# EAGLE design papilio_cam_board (EAGLE 6.2)
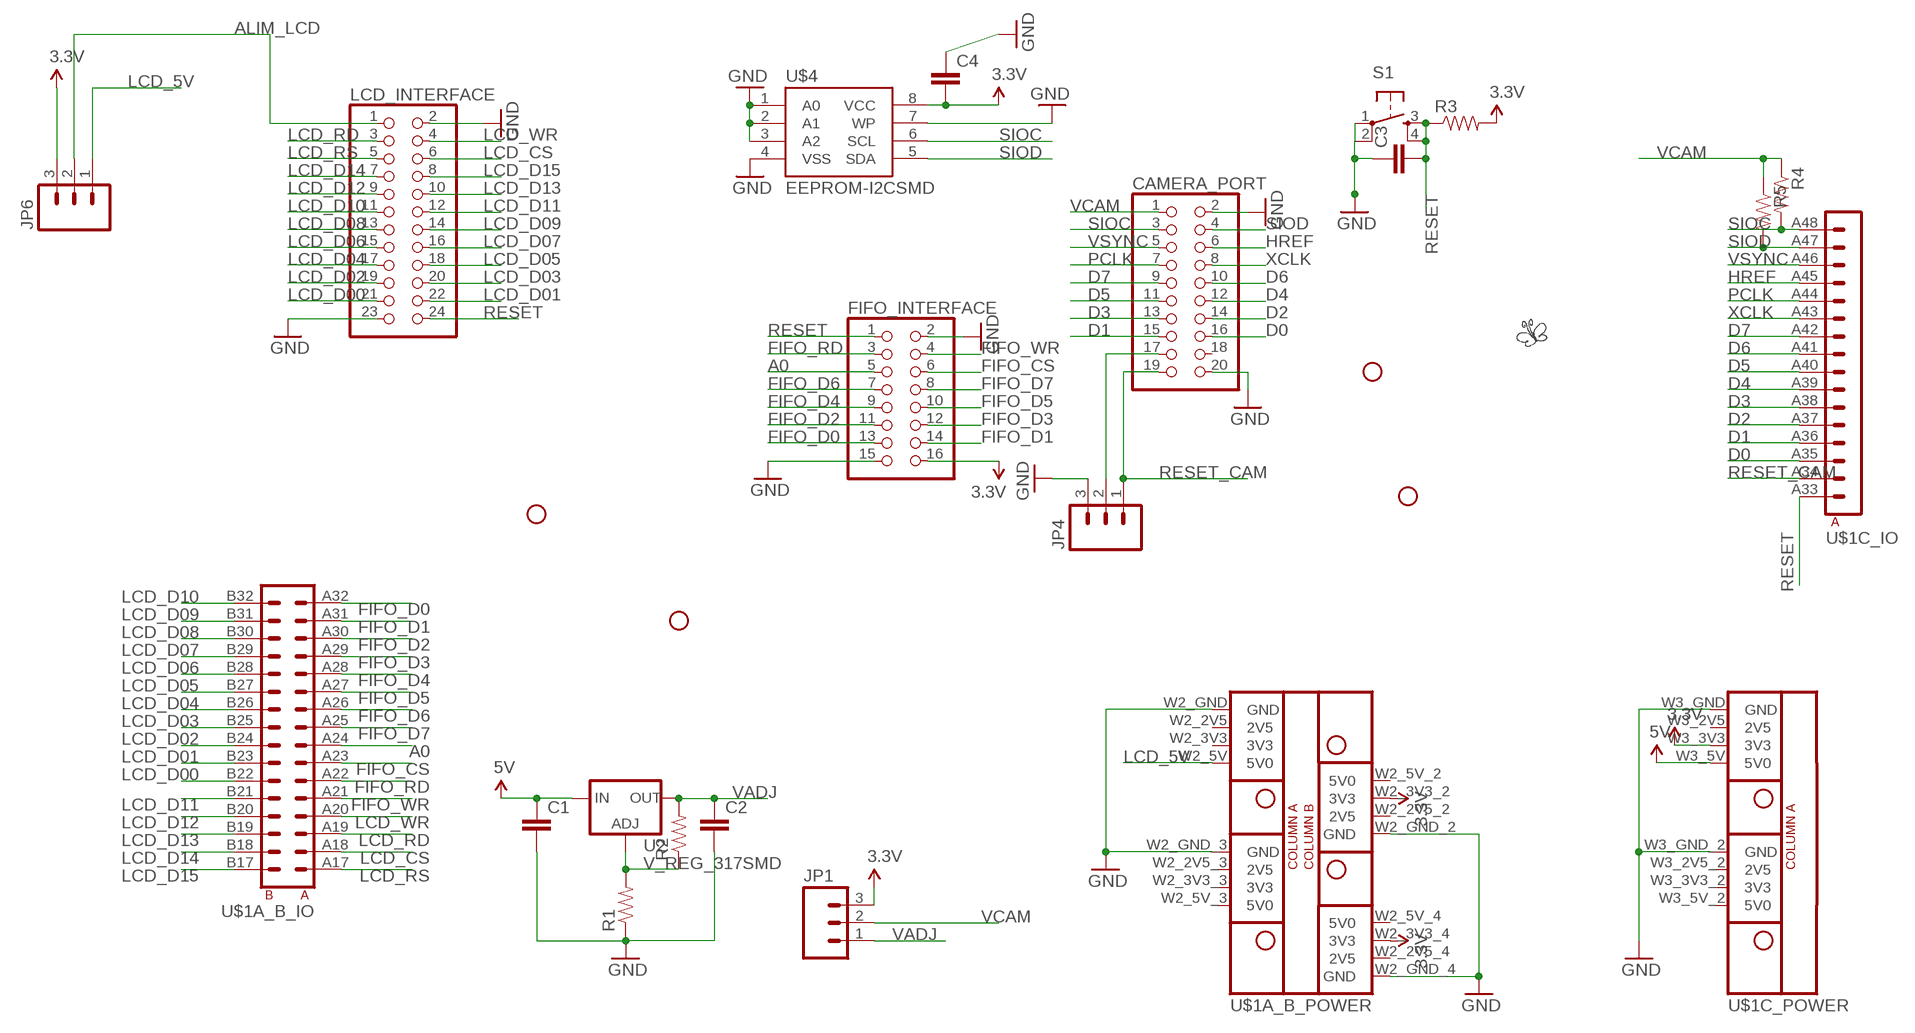
[diagram p0: schematic, sheet 1]

## Parts
C1  CAP0805  [0805]
C2  CAP0805  [0805]
C3  CAP0805  [0805]
C4  CAP0805  [0805]
CAMERA_PORT  PINHD-2X10  [2X10]
FIFO_INTERFACE  PINHD-2X8  [2X08]
JP1  M03PTH  [1X03]
JP2  STAND-OFF  [STAND-OFF]
JP3  STAND-OFF  [STAND-OFF]
JP4  M03PTH  [1X03]
JP5  STAND-OFF  [STAND-OFF]
JP6  M03PTH  [1X03]
JP7  STAND-OFF  [STAND-OFF]
LCD_INTERFACE  PINHD-2X12  [2X12]
LOGO1  BUTTERFLY_LOGO  [BUTTERFLY_LOGO]
R1  RESISTOR0805-RES  [0805]
R2  RESISTOR0805-RES  [0805]
R3  RESISTOR0805-RES  [0805]
R4  RESISTOR0805-RES  [0805]
R5  RESISTOR0805-RES  [0805]
S1  TAC_SWITCHSMD  [TACTILE_SWITCH_SMD]
U2  V_REG_317SMD  [SOT223]
U$1  MEGAWING_FULL_P1MEGAWING_P1  [MEGAWING_FULL_NOHOLES_P1]
U$4  EEPROM-I2CSMD  [SO08]

## Nets
3.3V: C4.2 FIFO_INTERFACE.16 JP1.3 JP6.3 R3.2 U$1.W2_3V3_2(A_B_POWER:3V3) U$1.W2_3V3_4(A_B_POWER:3V3) U$1.W3_3V3(C_POWER:3V3) U$4.8(VCC)
5V: C1.1 U2.3(IN) U$1.W3_5V(C_POWER:5V0)
A0: FIFO_INTERFACE.5 U$1.A24(A_B_IO:A8)
ALIM_LCD: JP6.2 LCD_INTERFACE.1
D0: CAMERA_PORT.16 U$1.A35(C_IO:A3)
D1: CAMERA_PORT.15 U$1.A36(C_IO:A4)
D2: CAMERA_PORT.14 U$1.A37(C_IO:A5)
D3: CAMERA_PORT.13 U$1.A38(C_IO:A6)
D4: CAMERA_PORT.12 U$1.A39(C_IO:A7)
D5: CAMERA_PORT.11 U$1.A40(C_IO:A8)
D6: CAMERA_PORT.10 U$1.A41(C_IO:A9)
D7: CAMERA_PORT.9 U$1.A42(C_IO:A10)
FIFO_CS: FIFO_INTERFACE.6 U$1.A23(A_B_IO:A7)
FIFO_D0: FIFO_INTERFACE.13 U$1.A32(A_B_IO:A16)
FIFO_D1: FIFO_INTERFACE.14 U$1.A31(A_B_IO:A15)
FIFO_D2: FIFO_INTERFACE.11 U$1.A30(A_B_IO:A14)
FIFO_D3: FIFO_INTERFACE.12 U$1.A29(A_B_IO:A13)
FIFO_D4: FIFO_INTERFACE.9 U$1.A28(A_B_IO:A12)
FIFO_D5: FIFO_INTERFACE.10 U$1.A27(A_B_IO:A11)
FIFO_D6: FIFO_INTERFACE.7 U$1.A26(A_B_IO:A10)
FIFO_D7: FIFO_INTERFACE.8 U$1.A25(A_B_IO:A9)
FIFO_RD: FIFO_INTERFACE.3 U$1.A22(A_B_IO:A6)
FIFO_WR: FIFO_INTERFACE.4 U$1.A21(A_B_IO:A5)
GND: C1.2 C2.2 C3.1 C4.1 CAMERA_PORT.2 CAMERA_PORT.20 FIFO_INTERFACE.2 FIFO_INTERFACE.15 JP4.3 LCD_INTERFACE.2 LCD_INTERFACE.23 R1.1 S1.1 S1.2 U$1.W2_GND(A_B_POWER:GND) U$1.W2_GND_2(A_B_POWER:GND) U$1.W2_GND_3(A_B_POWER:GND) U$1.W2_GND_4(A_B_POWER:GND) U$1.W3_GND(C_POWER:GND) U$1.W3_GND_2(C_POWER:GND) U$4.1(A0) U$4.2(A1) U$4.3(A2) U$4.4(VSS) U$4.7(WP)
HREF: CAMERA_PORT.6 U$1.A45(C_IO:A13)
LCD_5V: JP6.1 U$1.W2_5V(A_B_POWER:5V0)
LCD_CS: LCD_INTERFACE.6 U$1.A18(A_B_IO:A2)
LCD_D00: LCD_INTERFACE.21 U$1.B22(A_B_IO:B6)
LCD_D01: LCD_INTERFACE.22 U$1.B23(A_B_IO:B7)
LCD_D02: LCD_INTERFACE.19 U$1.B24(A_B_IO:B8)
LCD_D03: LCD_INTERFACE.20 U$1.B25(A_B_IO:B9)
LCD_D04: LCD_INTERFACE.17 U$1.B26(A_B_IO:B10)
LCD_D05: LCD_INTERFACE.18 U$1.B27(A_B_IO:B11)
LCD_D06: LCD_INTERFACE.15 U$1.B28(A_B_IO:B12)
LCD_D07: LCD_INTERFACE.16 U$1.B29(A_B_IO:B13)
LCD_D08: LCD_INTERFACE.13 U$1.B30(A_B_IO:B14)
LCD_D09: LCD_INTERFACE.14 U$1.B31(A_B_IO:B15)
LCD_D10: LCD_INTERFACE.11 U$1.B32(A_B_IO:B16)
LCD_D11: LCD_INTERFACE.12 U$1.B21(A_B_IO:B5)
LCD_D12: LCD_INTERFACE.9 U$1.B20(A_B_IO:B4)
LCD_D13: LCD_INTERFACE.10 U$1.B19(A_B_IO:B3)
LCD_D14: LCD_INTERFACE.7 U$1.B18(A_B_IO:B2)
LCD_D15: LCD_INTERFACE.8 U$1.B17(A_B_IO:B1)
LCD_RD: LCD_INTERFACE.3 U$1.A19(A_B_IO:A3)
LCD_RS: LCD_INTERFACE.5 U$1.A17(A_B_IO:A1)
LCD_WR: LCD_INTERFACE.4 U$1.A20(A_B_IO:A4)
N$1: R1.2 R2.1 U2.1(ADJ)
N$2: CAMERA_PORT.17 JP4.2
PCLK: CAMERA_PORT.7 U$1.A44(C_IO:A12)
RESET: C3.2 FIFO_INTERFACE.1 LCD_INTERFACE.24 R3.1 S1.3 S1.4 U$1.A33(C_IO:A1)
RESET_CAM: CAMERA_PORT.19 JP4.1 U$1.A34(C_IO:A2)
SIOC: CAMERA_PORT.3 R4.2 U$1.A48(C_IO:A16) U$4.6(SCL)
SIOD: CAMERA_PORT.4 R5.2 U$1.A47(C_IO:A15) U$4.5(SDA)
VADJ: C2.1 JP1.1 R2.2 U2.2(OUT)
VCAM: CAMERA_PORT.1 JP1.2 R4.1 R5.1
VSYNC: CAMERA_PORT.5 U$1.A46(C_IO:A14)
XCLK: CAMERA_PORT.8 U$1.A43(C_IO:A11)
Unconnected: CAMERA_PORT.18 U$1.W2_2V5(A_B_POWER:2V5) U$1.W2_2V5_2(A_B_POWER:2V5) U$1.W2_2V5_3(A_B_POWER:2V5) U$1.W2_2V5_4(A_B_POWER:2V5) U$1.W2_3V3(A_B_POWER:3V3) U$1.W2_3V3_3(A_B_POWER:3V3) U$1.W2_5V_2(A_B_POWER:5V0) U$1.W2_5V_3(A_B_POWER:5V0) U$1.W2_5V_4(A_B_POWER:5V0) U$1.W3_2V5(C_POWER:2V5) U$1.W3_2V5_2(C_POWER:2V5) U$1.W3_3V3_2(C_POWER:3V3) U$1.W3_5V_2(C_POWER:5V0)

## Library data of the parts
C1-C4 = SparkFun:CAP: Capacitor Standard 0603 ceramic capacitor, and 0.1" leaded capacitor.
CAMERA_PORT = pinhead:PINHD-2X10: PIN HEADER
FIFO_INTERFACE = pinhead:PINHD-2X8: PIN HEADER
JP1 JP4 JP6 = SparkFun:M03: Header 3 Standard 3-pin 0.1" header. Use with straight break away headers (SKU : PRT-00116), right angle break away headers (PRT-00553), swiss pins (PRT-00743), machine pins (PRT-00117), and female headers (PRT-00115). Molex polarized connector foot print use with SKU : PRT-08232 with associated crimp pins and housings.
JP2 JP3 JP5 JP7 = SparkFun:STAND-OFF: Stand Off This is the mechanical footprint for a #4 phillips button head screw. Use the keepout ring to avoid running the screw head into surrounding components. SKU : PRT-00447
LCD_INTERFACE = pinhead:PINHD-2X12: PIN HEADER
LOGO1 = Papilio:BUTTERFLY_LOGO
R1-R5 = SparkFun:RESISTOR: Resistor Basic schematic elements and footprints for 0603, 1206, and PTH resistors.
S1 = SparkFun:TAC_SWITCH: Momentary Switch Button commonly used for reset or general input. Spark Fun Electronics SKU : COM-00097
U2 = SparkFun:V_REG_317: Voltage Regulator Standard LM317 adjustable voltage regulator. AOI (Adjust Output Input). Google 'LM317 Calculator' for easy to use app to get the two resistor values needed. 240/720 for 5V output. 240/390 for 3.3V output. Spark Fun Electronics SKU : COM-00527
U$1 = Papilio:MEGAWING_FULL_P1
U$4 = SparkFun:EEPROM-I2C

## Board
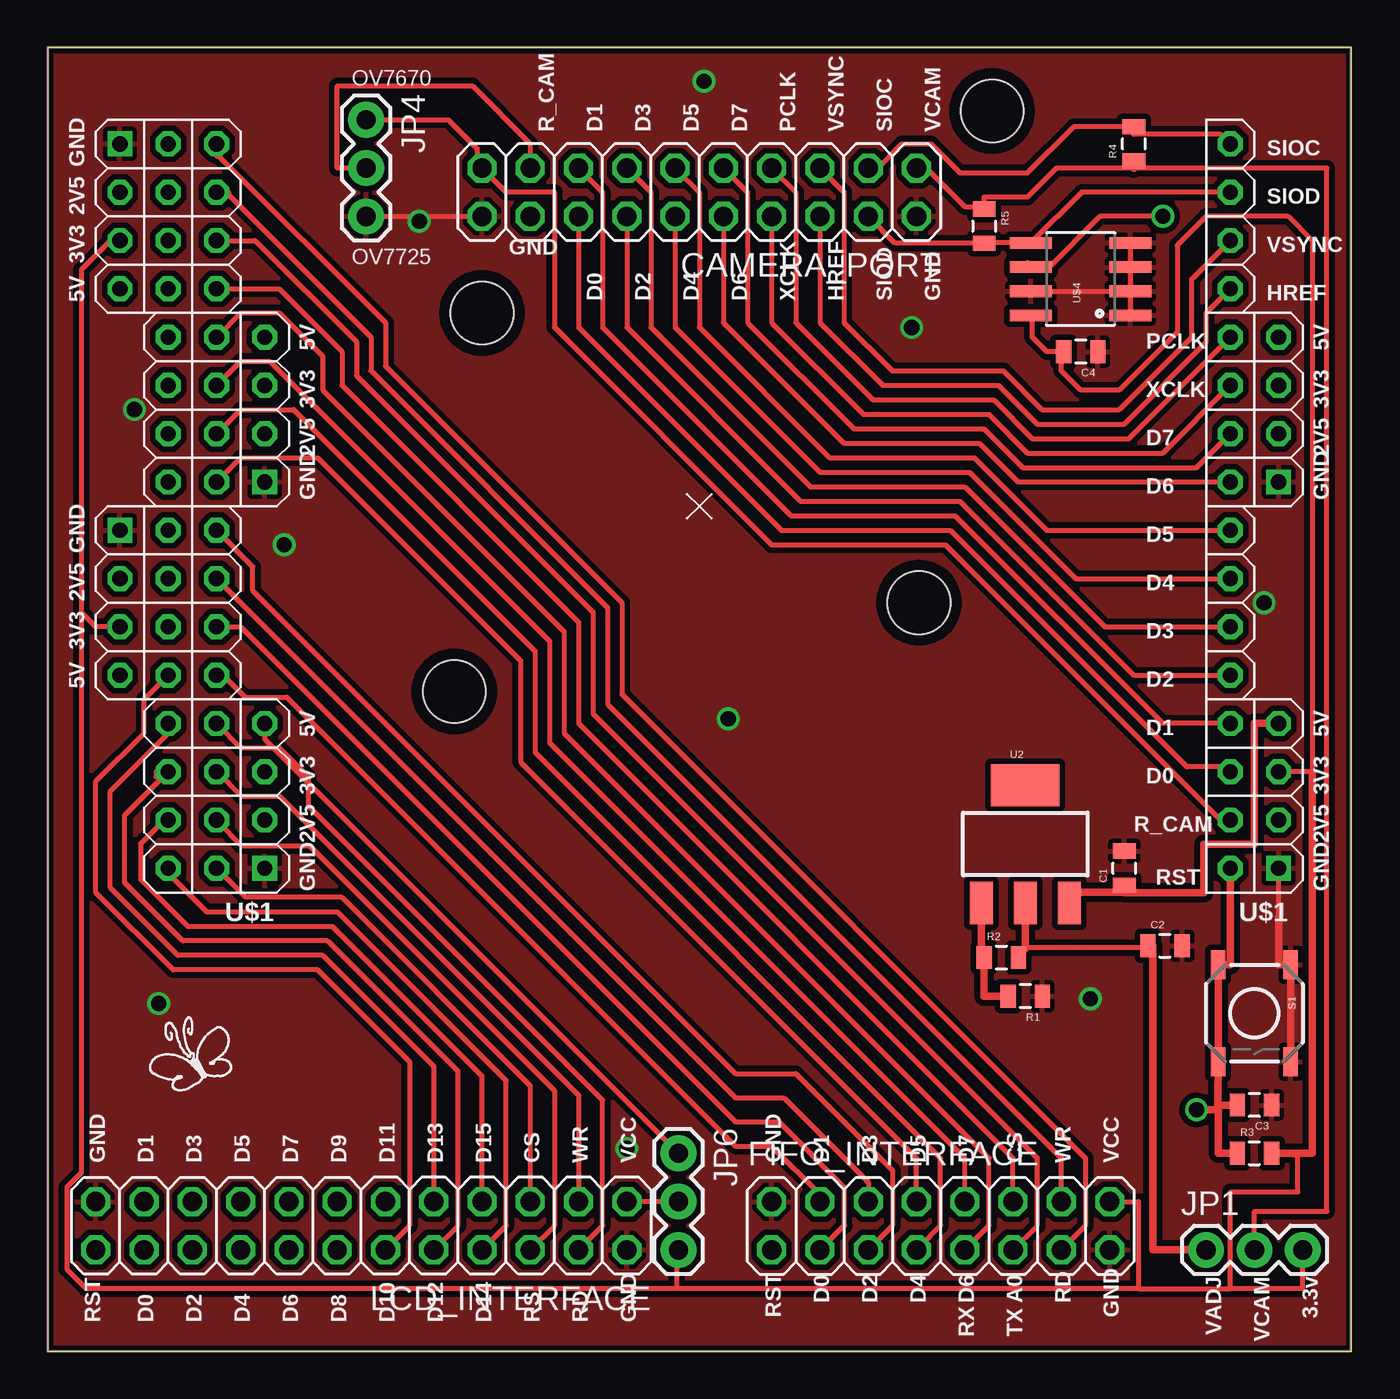
[diagram p1: board, top side]
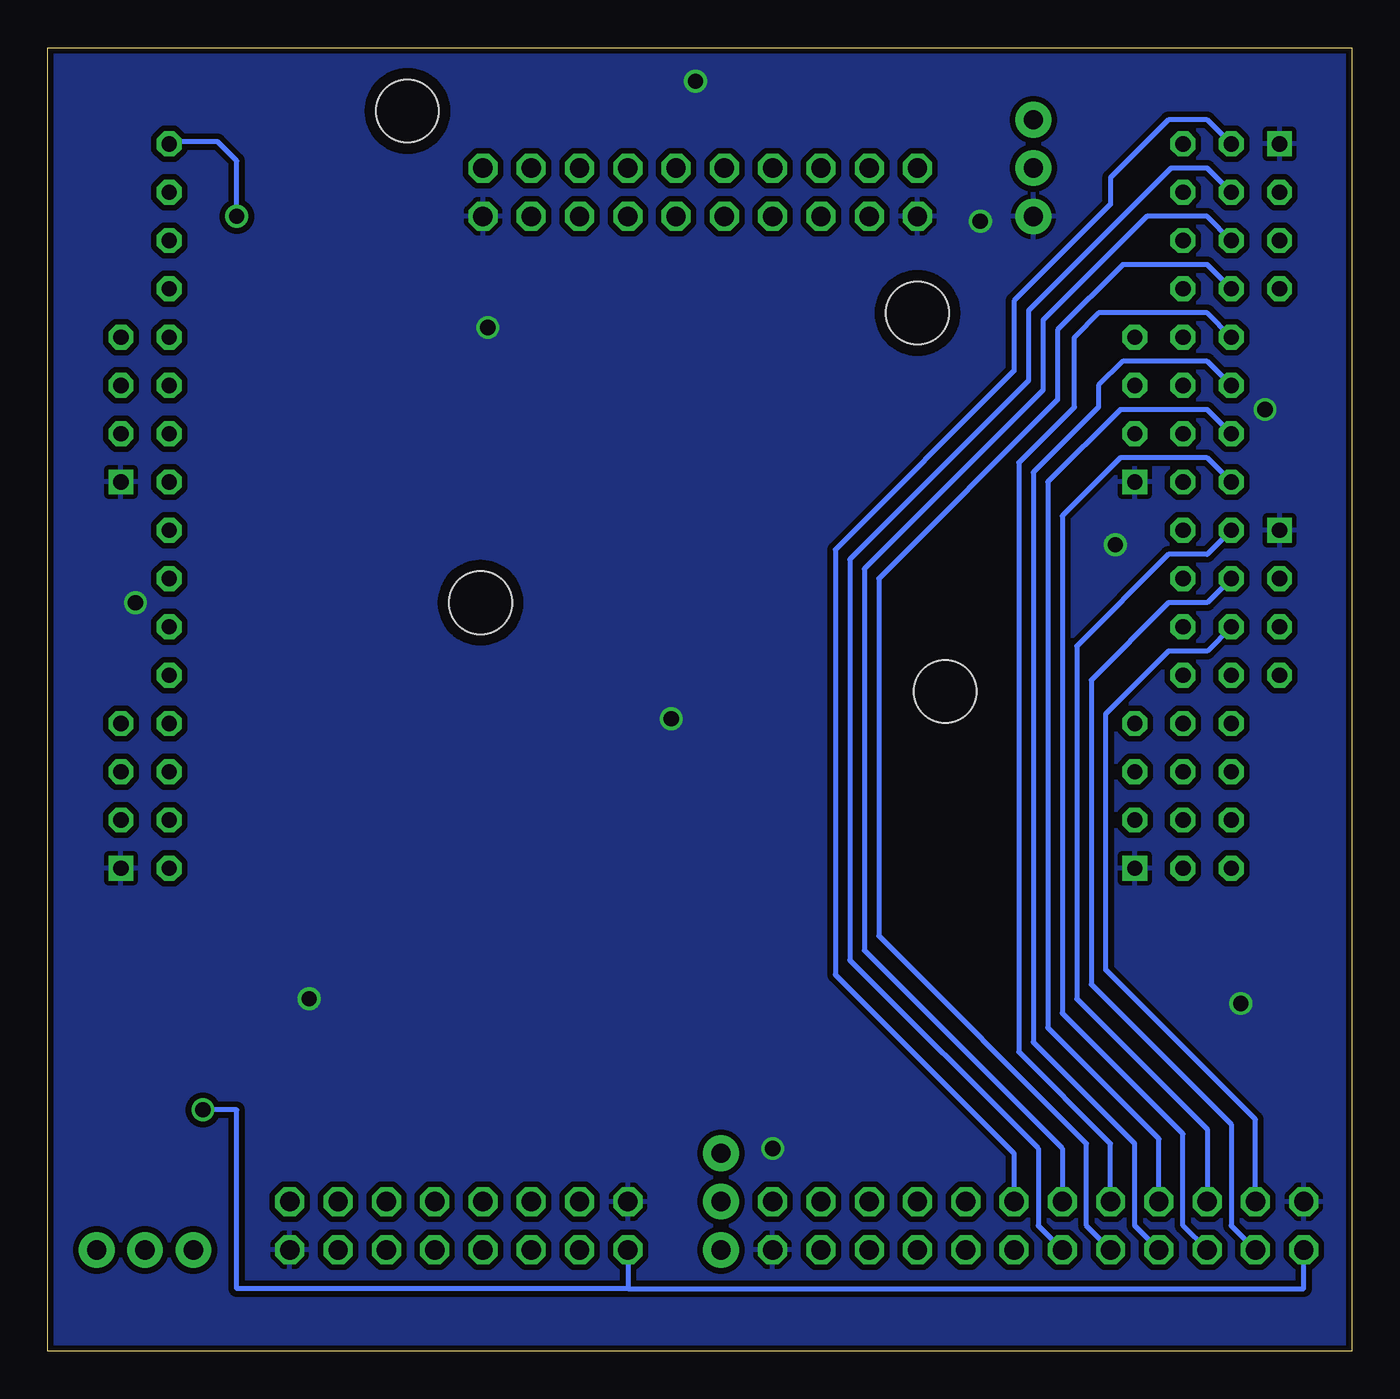
[diagram p2: board, bottom side, seen from below]

Size 68.63 x 68.57 mm. Coordinates in mm from the lower left corner, seen from the top.
Outline: 0,0 68.63,0 68.63,68.57 0,68.57 0,0
Copper layers (1*16): Top 0.035mm / dielectric 1.5mm / Bottom 0.035mm
Design rules: minimum track width 6mil, minimum drill 12mil, track to track 6mil, track to pad 6mil, pad to pad 6mil, via to via 6mil, smd to smd 0mil, copper to edge 10mil, drill to drill 10mil, minimum pad ring 10mil, minimum via ring 6mil, stop-mask expansion 2mil, vias tented up to drill 100mil, thermal gap 10mil

### Footprints (pad centres in the part's own frame; a part is rotated, then mirrored left to right if it is on the bottom)
0805 = smd 0.8 x 1.2: 1 -0.9,0; 2 0.9,0
2X10 = drill 1.016 octagon: 1 -11.43,-1.27; 2 -11.43,1.27; 3 -8.89,-1.27; 4 -8.89,1.27; 5 -6.35,-1.27; 6 -6.35,1.27; 7 -3.81,-1.27; 8 -3.81,1.27; 9 -1.27,-1.27; 10 -1.27,1.27; 11 1.27,-1.27; 12 1.27,1.27; 13 3.81,-1.27; 14 3.81,1.27; 15 6.35,-1.27; 16 6.35,1.27; 17 8.89,-1.27; 18 8.89,1.27; 19 11.43,-1.27; 20 11.43,1.27
2X08 = drill 1.016 octagon: 1 -8.89,-1.27; 2 -8.89,1.27; 3 -6.35,-1.27; 4 -6.35,1.27; 5 -3.81,-1.27; 6 -3.81,1.27; 7 -1.27,-1.27; 8 -1.27,1.27; 9 1.27,-1.27; 10 1.27,1.27; 11 3.81,-1.27; 12 3.81,1.27; 13 6.35,-1.27; 14 6.35,1.27; 15 8.89,-1.27; 16 8.89,1.27
1X03 = drill 1.016 pad 1.88: 1 0,0; 2 2.54,0; 3 5.08,0
STAND-OFF = hole 3.302: 0,0
2X12 = drill 1.016 octagon: 1 -13.97,-1.27; 2 -13.97,1.27; 3 -11.43,-1.27; 4 -11.43,1.27; 5 -8.89,-1.27; 6 -8.89,1.27; 7 -6.35,-1.27; 8 -6.35,1.27; 9 -3.81,-1.27; 10 -3.81,1.27; 11 -1.27,-1.27; 12 -1.27,1.27; 13 1.27,-1.27; 14 1.27,1.27; 15 3.81,-1.27; 16 3.81,1.27; 17 6.35,-1.27; 18 6.35,1.27; 19 8.89,-1.27; 20 8.89,1.27; 21 11.43,-1.27; 22 11.43,1.27; 23 13.97,-1.27; 24 13.97,1.27
TACTILE_SWITCH_SMD = smd 1.524 x 0.762: 1 -2.54,1.905; 2 2.54,1.905; 3 -2.54,-1.905; 4 2.54,-1.905
SOT223 = smd 1.219 x 2.235: 1 -2.311,-3.099; 2 0,-3.099; 3 2.311,-3.099 | smd 3.6 x 2.2: 4 0,3.099
MEGAWING_FULL_NOHOLES_P1 = drill 0.8 octagon: A17 59.69,43.18; A18 59.69,40.64; A19 59.69,38.1; A20 59.69,35.56; A21 59.69,33.02; A22 59.69,30.48; A23 59.69,27.94; A24 59.69,25.4; A25 59.69,22.86; A26 59.69,20.32; A27 59.69,17.78; A28 59.69,15.24; A29 59.69,12.7; A30 59.69,10.16; A31 59.69,7.62; A32 59.69,5.08; A33 6.35,43.18; A34 6.35,40.64; A35 6.35,38.1; A36 6.35,35.56; A37 6.35,33.02; A38 6.35,30.48; A39 6.35,27.94; A40 6.35,25.4; A41 6.35,22.86; A42 6.35,20.32; A43 6.35,17.78; A44 6.35,15.24; A45 6.35,12.7; A46 6.35,10.16; A47 6.35,7.62; A48 6.35,5.08; B17 62.23,43.18; B18 62.23,40.64; B19 62.23,38.1; B20 62.23,35.56; B21 62.23,33.02; B22 62.23,30.48; B23 62.23,27.94; B24 62.23,25.4; B25 62.23,22.86; B26 62.23,20.32; B27 62.23,17.78; B28 62.23,15.24; B29 62.23,12.7; B30 62.23,10.16; B31 62.23,7.62; B32 62.23,5.08; W2_2V5 57.15,40.64; W2_2V5_2 64.77,27.94; W2_2V5_3 57.15,20.32; W2_2V5_4 64.77,7.62; W2_3V3 57.15,38.1; W2_3V3_2 64.77,30.48; W2_3V3_3 57.15,17.78; W2_3V3_4 64.77,10.16; W2_5V 57.15,35.56; W2_5V_2 64.77,33.02; W2_5V_3 57.15,15.24; W2_5V_4 64.77,12.7; W3_2V5 3.81,40.64; W3_2V5_2 3.81,20.32; W3_3V3 3.81,38.1; W3_3V3_2 3.81,17.78; W3_5V 3.81,35.56; W3_5V_2 3.81,15.24 | drill 0.8 square: W2_GND 57.15,43.18; W2_GND_2 64.77,25.4; W2_GND_3 57.15,22.86; W2_GND_4 64.77,5.08; W3_GND 3.81,43.18; W3_GND_2 3.81,22.86
SO08 = smd 0.61 x 2.21: 1 -1.905,-2.616; 2 -0.635,-2.616; 3 0.635,-2.616; 4 1.905,-2.616; 5 1.905,2.616; 6 0.635,2.616; 7 -0.635,2.616; 8 -1.905,2.616

### Placement (x,y rotation side)
C1  56.65,25.41 90 top
C2  58.79,21.33 0 top
C3  63.5,12.95 180 top
C4  54.36,52.58 180 top
CAMERA_PORT  34.29,60.96 180 top
FIFO_INTERFACE  46.99,6.6 0 top
JP1  60.96,5.33 0 top
JP2  21.4,34.7 0 top
JP3  49.69,65.23 0 top
JP4  16.76,64.77 270 top
JP5  22.86,54.61 0 top
JP6  33.2,10.41 270 top
JP7  45.85,39.37 0 top
LCD_INTERFACE  16.51,6.6 180 top
LOGO1  7.62,15.11 0 top
R1  51.44,18.68 180 top
R2  50.17,20.71 0 top
R3  63.5,10.41 0 top
R4  57.15,63.5 90 top
R5  49.28,59.18 270 top
S1  63.5,17.78 270 top
U2  51.44,26.68 0 top
U$1  68.58,68.58 180 top
U$4  54.36,56.39 90 top

### Tracks (layer width: path | path; a pad name or v marks a point on that pad's centre or on a via)
3.3V
  Top 0.254: 57.4,3.3 62.23,3.3 | 62.23,3.3 62.23,8.38 65.79,8.38 65.79,10.3 R3.2 | U$1.W3_3V3 66.55,30.48 66.55,58.42 65.28,59.69 60.96,59.69 59.44,58.17 59.44,53.59 56.39,50.55 54.36,50.55 53.34,51.56 53.34,52.46 C4.2 52.58,52.58 51.82,53.34 51.82,54.41 U$4.8 51.61,54.36 | FIFO_INTERFACE.16 57.4,7.87 57.4,3.3 | 62.23,3.3 66.04,3.3 JP1.3 | U$1.W2_3V3_4 3.3,58.42 1.78,56.9 1.78,38.86 | 1.78,38.86 1.78,9.4 1.02,8.64 1.02,4.32 2.03,3.3 33.1,3.3 | 57.4,3.3 33.1,3.3 | U$1.W2_3V3_2 2.54,38.1 1.78,38.86 | JP6.3 33.1,5.33 33.1,3.3
  Top 0.406: R3.2 66.55,10.41 66.55,30.48
5V
  Top 0.406: U$1.W3_5V 63.5,33.02 63.5,26.67 60.83,26.67 60.83,24.13 56.65,24.13 C1.1 56.78,24.51 56.78,24.14 53.76,24.14 U2.3
A0
  Top 0.254: FIFO_INTERFACE.5 44.45,6.6 44.45,9.53 39.37,14.61 36.2,14.61 10.79,40.01 10.79,41.27 U$1.A24
ALIM_LCD
  Top 0.254: JP6.2 LCD_INTERFACE.1
D0
  Top 0.254: U$1.A35 62.23,30.73 59.94,30.73 47.5,43.18 38.61,43.18 27.94,53.85 CAMERA_PORT.16
D1
  Top 0.254: U$1.A36 58.67,33.02 47.75,43.94 39.12,43.94 29.21,53.85 29.21,60.96 CAMERA_PORT.15
D2
  Top 0.254: CAMERA_PORT.14 30.48,53.85 39.62,44.7 48.01,44.7 57.15,35.56 U$1.A37
D3
  Top 0.254: CAMERA_PORT.13 31.75,60.96 31.75,53.85 40.13,45.47 48.26,45.47 55.63,38.1 U$1.A38
D4
  Top 0.254: CAMERA_PORT.12 33.02,53.85 40.64,46.23 48.51,46.23 54.1,40.64 U$1.A39
D5
  Top 0.254: CAMERA_PORT.11 34.29,60.96 34.29,53.85 41.15,46.99 48.77,46.99 52.58,43.18 U$1.A40
D6
  Top 0.254: 61.98,45.72 U$1.A41 51.05,45.72 49.02,47.75 41.91,47.75 35.56,54.1 CAMERA_PORT.10
D7
  Top 0.254: CAMERA_PORT.9 36.83,60.96 36.83,54.1 42.42,48.51 49.28,48.51 51.31,46.48 60.45,46.48 U$1.A42
FIFO_CS
  Top 0.254: U$1.A23 8.95,40.7 8.95,40.55 8.98,40.55 36.2,13.34 38.73,13.34 43.18,8.89 FIFO_INTERFACE.6
FIFO_D0
  Top 0.254: FIFO_INTERFACE.13 54.61,6.6 54.61,10.16 30.23,34.54 30.23,39.37 17.78,51.82 17.78,54.1 9.02,62.87 8.89,62.87 U$1.A32
FIFO_D1
  Top 0.254: FIFO_INTERFACE.14 53.34,10.16 29.46,34.04 29.46,39.12 17.02,51.56 17.02,53.34 9.53,60.83 9.53,60.96 U$1.A31
FIFO_D2
  Top 0.254: FIFO_INTERFACE.11 52.07,6.6 52.07,10.16 28.7,33.53 28.7,38.86 16.26,51.31 16.26,53.09 10.92,58.42 U$1.A30
FIFO_D3
  Top 0.254: FIFO_INTERFACE.12 50.8,10.16 27.94,33.02 27.94,38.35 15.49,50.8 15.49,52.58 12.19,55.88 U$1.A29
FIFO_D4
  Top 0.254: FIFO_INTERFACE.9 49.53,6.6 49.53,10.16 27.18,32.51 27.18,37.85 14.48,50.55 14.48,52.32 12.19,54.61 10.16,54.61 U$1.A28
FIFO_D5
  Top 0.254: FIFO_INTERFACE.10 48.26,10.16 26.42,32 26.42,37.34 11.68,52.07 10.16,52.07 U$1.A27
FIFO_D6
  Top 0.254: FIFO_INTERFACE.7 45.97,5.33 45.97,5.59 46.99,6.6 46.99,10.16 25.65,31.5 25.65,36.83 12.95,49.53 10.16,49.53 U$1.A26
FIFO_D7
  Top 0.254: FIFO_INTERFACE.8 45.72,10.16 24.89,30.99 24.89,36.32 14.22,46.99 10.16,46.99 U$1.A25
FIFO_RD
  Top 0.254: FIFO_INTERFACE.3 41.91,6.6 41.94,6.6 41.91,6.63 41.91,8.64 38.48,12.06 36.2,12.06 10.16,38.1 U$1.A22
FIFO_WR
  Top 0.254: U$1.A21 9.24,35.56 10.4,34.4 12.59,34.4 36.2,10.79 38.1,10.79 40.64,8.26 | 40.64,8.38 40.64,8.26 | 40.64,8.26 FIFO_INTERFACE.4
GND  (via drill 0.8)
  Top 0.254: 64.77,22.86 U$1.W3_GND | U$4.4 U$4.3 U$4.2 | U$4.2 U$4.1 | U$4.7 U$4.2 | JP4.3 CAMERA_PORT.20
  Top 0.406: S1.2 S1.1 64.77,20.32 64.77,22.86 | C2.2
  other vias: 54.86,18.54 45.47,53.85 12.45,42.42 30.48,10.67 35.81,33.27 4.57,49.53 64.01,39.37 34.54,66.8 19.56,59.44 5.84,18.29
  pour Bottom (isolate 0.305): 0.25,68.83 68.58,68.83 68.58,-0.25 0,-0.25 0,69.09
  pour Top (isolate 0.305): 0,68.58 68.58,68.58 68.58,-0.64 0,-0.64
HREF
  Top 0.254: CAMERA_PORT.6 40.64,54.1 43.94,50.8 50.04,50.8 52.07,48.77 56.64,48.77 60.96,53.09 60.96,54.61 U$1.A45
LCD_5V
  Top 0.254: U$1.W2_5V 11.43,32.18 JP6.1
LCD_CS
  Top 0.254: LCD_INTERFACE.6 26.67,6.6 26.67,13.72 13.79,26.6 10.2,26.6 8.94,27.86 8.94,27.94 U$1.A18
LCD_D00
  Bottom 0.254: U$1.B22 7.62,36.83 9.65,36.83 12.83,33.66 12.95,33.53 12.95,20.07 5.08,12.19 LCD_INTERFACE.21
LCD_D01
  Bottom 0.254: LCD_INTERFACE.22 6.35,6.6 6.35,11.94 13.72,19.3 13.72,35.31 9.65,39.37 7.62,39.37 U$1.B23
LCD_D02
  Bottom 0.254: U$1.B24 7.62,41.91 9.65,41.91 14.48,37.08 14.48,18.54 7.62,11.68 LCD_INTERFACE.19
LCD_D03
  Bottom 0.254: LCD_INTERFACE.20 8.89,6.6 8.89,11.43 15.24,17.78 15.24,43.94 12.19,46.99 7.62,46.99 U$1.B25
LCD_D04
  Bottom 0.254: U$1.B26 7.62,49.53 12.19,49.53 16,45.72 16,17.02 10.16,11.18 LCD_INTERFACE.17
LCD_D05
  Bottom 0.254: LCD_INTERFACE.18 11.43,6.6 11.43,10.92 16.76,16.26 16.76,46.23 13.34,49.66 13.34,50.8 12.06,52.07 7.62,52.07 U$1.B27
LCD_D06
  Bottom 0.254: U$1.B28 7.62,54.61 13.34,54.61 14.61,53.34 14.61,49.66 17.53,46.74 17.53,15.75 12.7,10.92 LCD_INTERFACE.15
LCD_D07
  Bottom 0.254: LCD_INTERFACE.16 13.97,6.6 13.97,10.92 24.89,21.84 24.89,40.64 15.49,50.04 15.49,53.72 12.06,57.15 7.62,57.15 U$1.B29
LCD_D08
  Bottom 0.254: U$1.B30 7.62,59.69 10.79,59.69 16.26,54.23 16.26,50.55 25.65,41.15 25.65,21.08 15.24,10.67 LCD_INTERFACE.13
LCD_D09
  Bottom 0.254: LCD_INTERFACE.14 16.51,6.6 16.51,10.67 26.42,20.57 26.42,41.66 17.02,51.05 17.02,54.74 9.53,62.23 7.62,62.23 U$1.B31
LCD_D10
  Bottom 0.254: LCD_INTERFACE.11 17.78,10.41 27.18,19.81 27.18,42.16 17.78,51.56 17.78,55.24 12.7,60.33 12.7,61.72 9.65,64.77 7.62,64.77 U$1.B32
LCD_D11
  Top 0.254: LCD_INTERFACE.12 19.05,6.6 19.05,15.24 14.22,20.07 6.6,20.07 2.54,24.13 2.54,29.97 5.08,32.51 5.08,34.29 U$1.B21 6.35,35.05
LCD_D12
  Top 0.254: U$1.B20 6.35,32.51 3.3,29.46 3.3,24.38 6.86,20.83 14.48,20.83 20.32,14.99 LCD_INTERFACE.9
LCD_D13
  Top 0.254: LCD_INTERFACE.10 21.59,6.6 21.59,14.73 14.73,21.59 7.11,21.59 4.06,24.64 4.06,28.19 U$1.B19 5.71,30.48 5.71,30.21
LCD_D14
  Top 0.254: LCD_INTERFACE.7 22.86,14.48 14.99,22.35 7.37,22.35 4.9,24.82 4.9,26.7 6.14,27.94 U$1.B18
LCD_D15
  Top 0.254: LCD_INTERFACE.8 24.13,6.6 24.13,14.22 15.24,23.11 8.38,23.11 6.35,25.15 U$1.B17
LCD_RD
  Top 0.254: U$1.A19 8.92,30.48 10.2,29.2 12.2,29.2 27.94,13.46 LCD_INTERFACE.3
LCD_RS
  Top 0.254: 25.3,7.97 LCD_INTERFACE.5 25.4,13.97 15.47,23.9 10.4,23.9 U$1.A17
LCD_WR
  Top 0.254: LCD_INTERFACE.4 29.21,6.6 29.21,13.21 13.72,28.7 13.72,30.23 12.19,31.75 10.25,31.75 10.2,31.7 U$1.A20
N$1
  Top 0.406: U2.1 49.13,21.22 R2.1 49.27,18.68 R1.2
N$2
  Top 0.254: JP4.2 15.24,62.23 15.24,66.55 22.35,66.55 25.4,63.5 CAMERA_PORT.17
PCLK
  Top 0.254: CAMERA_PORT.7 39.37,60.96 39.37,54.1 43.43,50.04 49.78,50.04 51.82,48.01 56.9,48.01 U$1.A44
RESET  (via drill 0.8)
  Top 0.406: 61.59,12.7 61.57,12.96 61.57,13.21 | 61.57,13.21 S1.4 S1.3 62.23,20.32 U$1.A33 | v60.45,12.7 61.59,12.7 | R3.1 61.59,10.41 61.59,12.7 | C3.2 61.57,12.95 61.57,13.21
  Bottom 0.254: 38.1,3.3 2.54,3.3 LCD_INTERFACE.24 | FIFO_INTERFACE.1 38.1,3.3 | 38.1,3.3 58.67,3.3 58.67,12.7 v60.45,12.7
RESET_CAM
  Top 0.254: 61.98,27.94 U$1.A34 61.72,27.94 47.24,42.42 38.1,42.42 26.67,53.85 26.67,60.96 24.13,60.96 CAMERA_PORT.19 22.61,62.48 22.61,63.25 21.08,64.77 JP4.1
SIOC  (via drill 0.8)
  Top 0.254: U$1.A48 62.23,63.63 | 51.56,57.28 U$4.6 51.87,56.9 52.58,56.9 55.37,59.69 v58.67,59.69 | CAMERA_PORT.3 43.69,62.23 44.96,63.5 46.48,63.5 48.01,61.98 51.56,61.98 53.99,64.4 R4.2 57.15,64.01 61.72,64.01 U$1.A48 | 62.09,63.64 U$1.A48
  Bottom 0.254: U$1.A48 62.1,63.63 59.69,63.63 58.67,62.61 v58.67,59.69
SIOD
  Top 0.254: 62.48,60.96 U$1.A47 54.41,60.96 U$4.5 49.03,58.29 R5.2 44.59,58.28 CAMERA_PORT.4 43.3,59.57
VADJ
  Top 0.254: 57.93,21.22 51.58,21.22 R2.2
  Top 0.406: JP1.1 58.17,5.33 58.17,21.33 C2.1 57.93,21.22 | R2.2 51.44,21.22 U2.2
VCAM
  Top 0.254: JP1.2 63.5,7.37 67.31,7.37 67.31,62.23 57.15,62.23 53.09,62.23 51.56,60.71 49.28,60.71 R5.1 | CAMERA_PORT.1 46.23,62.23 48.26,60.2 49.16,60.2 R5.1 | 49.39,60.2 R5.1 | 49.41,59.94 R5.1
  Top 0.406: R4.1 57.15,62.23
VSYNC
  Top 0.254: CAMERA_PORT.5 41.91,60.96 41.91,54.1 44.45,51.56 50.29,51.56 52.32,49.53 56.39,49.53 60.2,53.34 60.2,56.39 U$1.A46
XCLK
  Top 0.254: CAMERA_PORT.8 38.1,54.1 42.93,49.28 49.53,49.28 51.56,47.24 58.67,47.24 U$1.A43

### Text on the board
tPlace: OV7670 | R_CAM | D1 | D3 | D5 | D7 | PCLK | VSYNC | SIOC | VCAM | SIOC | SIOD | GND | VSYNC | OV7725 | D0 | D2 | D4 | D6 | XCLK | HREF | SIOD | GND | HREF | PCLK | XCLK | D7 | D6 | D5 | D4 | D3 | D2 | D1 | D0 | R_CAM | RST | GND | D1 | D3 | D5 | D7 | D9 | D11 | D13 | D15 | CS | WR | VCC | GND | D1 | D3 | D5 | D7 | CS | WR | VCC | VADJ | VCAM | 3.3v | D0 | D2 | D4 | D6 | A0 | RD | RST | D0 | D2 | D4 | D6 | D8 | D10 | D12 | D14 | RS | RD | GND | RST | GND | RX | TX